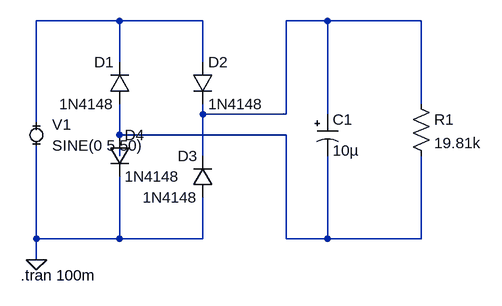
[diagram p0: schematic lab2_2.asc]
lab2_2.asc, the LTspice schematic file:
Version 4
SHEET 1 880 680
WIRE -144 0 -272 0
WIRE -16 0 -144 0
WIRE 176 0 112 0
WIRE 320 0 176 0
WIRE -144 64 -144 0
WIRE -16 64 -16 0
WIRE 320 128 320 0
WIRE -16 144 -16 128
WIRE 112 144 112 0
WIRE 112 144 -16 144
WIRE 176 144 176 0
WIRE -272 160 -272 0
WIRE -144 176 -144 128
WIRE 112 176 -144 176
WIRE -144 208 -144 176
WIRE -16 208 -16 144
WIRE -272 336 -272 192
WIRE -144 336 -144 240
WIRE -144 336 -272 336
WIRE -16 336 -16 272
WIRE -16 336 -144 336
WIRE 112 336 112 176
WIRE 176 336 176 208
WIRE 176 336 112 336
WIRE 320 336 320 208
WIRE 320 336 176 336
WIRE -272 368 -272 336
FLAG -272 368 0
SYMBOL MiniSyms4\\voltage- -272 176 R0
WINDOW 123 0 0 Left 2
WINDOW 39 0 0 Left 2
SYMATTR InstName V1
SYMATTR Value SINE(0 5 50)
SYMBOL diode -128 128 R180
WINDOW 0 24 64 Left 2
WINDOW 3 24 0 Left 2
SYMATTR InstName D1
SYMATTR Value 1N4148
SYMBOL diode -32 64 R0
SYMATTR InstName D2
SYMATTR Value 1N4148
SYMBOL diode 0 272 R180
WINDOW 0 24 64 Left 2
WINDOW 3 24 0 Left 2
SYMATTR InstName D3
SYMATTR Value 1N4148
SYMBOL diode -160 176 R0
SYMATTR InstName D4
SYMATTR Value 1N4148
SYMBOL polcap 160 144 R0
WINDOW 3 24 56 Left 2
SYMATTR Value 10µ
SYMATTR InstName C1
SYMATTR Description Capacitor
SYMATTR Type cap
SYMATTR SpiceLine V=16 Irms=35m Rser=2.8 Lser=0 mfg="Nichicon" pn="UPR1C100MAH" type="Al electrolytic"
SYMBOL res 304 112 R0
SYMATTR InstName R1
SYMATTR Value 19.81k
TEXT -296 392 Left 2 !.tran 100m

The netlist it stands for:
* lab2_2.asc
V1 N001 0 SINE(0 5 50)
D1 N003 N001 1N4148
D2 N001 N002 1N4148
D3 0 N002 1N4148
D4 N003 0 1N4148
C1 N002 N003 10µ V=16 Irms=35m Rser=2.8 Lser=0 mfg="Nichicon" pn="UPR1C100MAH" type="Al electrolytic"
R1 N002 N003 19.81k
.model D D
.lib standard.dio
.tran 100m
.backanno
.end